# Altium schematic sheet BUTTONs.SchDoc
size A4
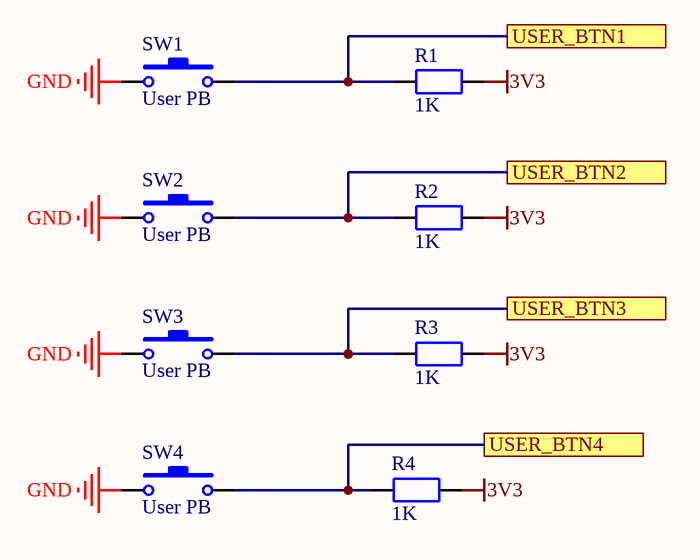
[diagram p0: BUTTONs.SchDoc]

## Parts
R1  1K  [0402_RES]
R2  1K  [0402_RES]
R3  1K  [0402_RES]
R4  1K  [0402_RES]
SW1  User PB  [SW-PB SMD KMR2]
SW2  User PB  [SW-PB SMD KMR2]
SW3  User PB  [SW-PB SMD KMR2]
SW4  User PB  [SW-PB SMD KMR2]

## Ports
USER_BTN1, USER_BTN2, USER_BTN3, USER_BTN4

## Nets
3V3: R1.2 R2.2 R3.2 R4.2
GND: SW1.1 SW2.1 SW3.1 SW4.1
USER_BTN1: R1.1 SW1.2 ; port USER_BTN1
USER_BTN2: R2.1 SW2.2 ; port USER_BTN2
USER_BTN3: R3.1 SW3.2 ; port USER_BTN3
USER_BTN4: R4.1 SW4.2 ; port USER_BTN4

## Library data of the parts
R1-R4 = RES: Resistor
SW1-SW4 = SW-PB_1: Push-button SMD; Order code RS: 102-412